# EAGLE schematic power (EAGLE 9.6.2)
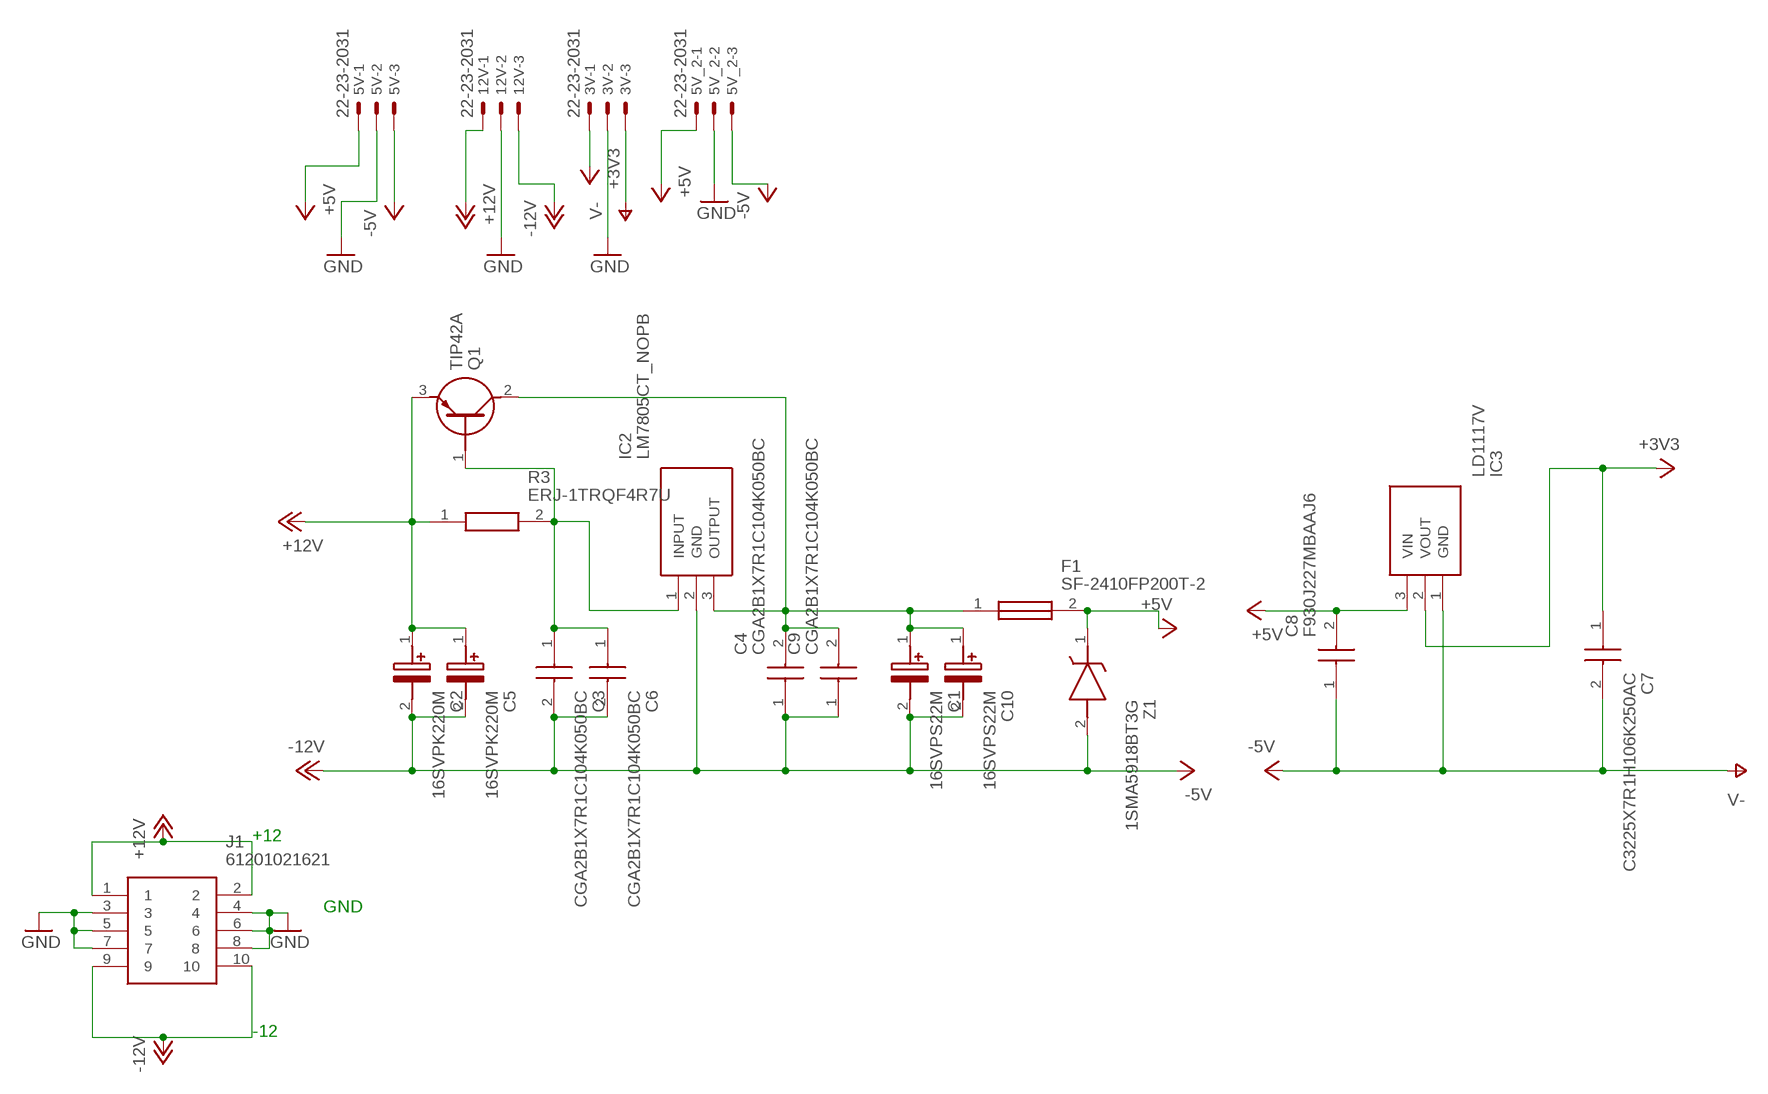
[diagram p0: schematic, sheet 1]

## Parts
3V  22-23-2031  [22-23-2031]
5V  22-23-2031  [22-23-2031]
5V_2  22-23-2031  [22-23-2031]
12V  22-23-2031  [22-23-2031]
C1  16SVPS22M  [CAPAE530X600N]
C2  16SVPK220M  [CAPAE660X600N]
C3  CGA2B1X7R1C104K050BC  [CAPC1005X55N]
C4  CGA2B1X7R1C104K050BC  [CAPC1005X55N]
C5  16SVPK220M  [CAPAE660X600N]
C6  CGA2B1X7R1C104K050BC  [CAPC1005X55N]
C7  C3225X7R1H106K250AC  [CAPC3225X230N]
C8  F930J227MBAAJ6  [CAPC3225X94N]
C9  CGA2B1X7R1C104K050BC  [CAPC1005X55N]
C10  16SVPS22M  [CAPAE530X600N]
F1  SF-2410FP200T-2  [FUSC6126X270N]
IC2  LM7805CT_NOPB  [TO254P470X1028X1955-3P]
IC3  LD1117V  [TO255P460X1020X2008-3P]
J1  61201021621  [SHDR10W64P254_2X5_2036X885X925]
Q1  TIP42A  [TO255P460X1020X2008-3P]
R3  ERJ-1TRQF4R7U  [RESC6332X71N]
Z1  1SMA5918BT3G  [DIOM5226X220N]

## Nets
+3V3: 3V.1 C7.1 IC3.2(VOUT)
+5V: 5V.1 5V_2.1 C8.2 F1.2 IC3.3(VIN) Z1.1(K)
+12V: 12V.1 C2.1(+) C5.1(+) J1.1 J1.2 Q1.3(E) R3.1(R1)
-5V: 5V.3 5V_2.3 C1.2(-) C2.2(-) C3.2 C4.1 C5.2(-) C6.2 C9.1 C10.2(-) IC2.2(GND) Z1.2(A) ; supply symbol labelled -12V
-12V: 12V.3 J1.9 J1.10
GND: 3V.2 5V.2 5V_2.2 12V.2 J1.3 J1.4 J1.5 J1.6 J1.7 J1.8
N$5: C3.1 C6.1 IC2.1(INPUT) Q1.1(B) R3.2(R2)
N$8: C1.1(+) C4.2 C9.2 C10.1(+) F1.1 IC2.3(OUTPUT) Q1.2(C)
V-: 3V.3 C7.2 C8.1 IC3.1(GND) ; supply symbol labelled -5V

## Notes on the sheet
- +12
- GND
- -12

## Library data of the parts
3V 5V 5V_2 12V = con-molex:22-23-2031: .100" (2.54mm) Center Header - 3 Pin; MF: MOLEX; MPN: 22-23-2031; OC_FARNELL: 1462950; OC_NEWARK: 30C0862
C1 C10 = SamacSys_Parts:16SVPS22M: Conductive Polymer Aluminum Solid Capacitor Source: Datasheet <https://industrial.panasonic.com/cdbs/www-data/pdf/AAB8000/AAB8000C232.pdf>; DESCRIPTION: Conductive Polymer Aluminum Solid Capacitor; HEIGHT: 6mm; MANUFACTURER_NAME: Panasonic; MANUFACTURER_PART_NUMBER: 16SVPS22M; MOUSER_PART_NUMBER: 667-16SVPS22M; MOUSER_PRICE-STOCK: https://www.mouser.co.uk/ProductDetail/Panasonic/16SVPS22M?qs=ZsfFHnjSocuR2p8724s91Q%3D%3D
C2 C5 = SamacSys_Parts:16SVPK220M: PANASONIC ELECTRONIC COMPONENTS - 16SVPK220M - CAP, 220UF, 16V, ALU ELEC, POLYMER, SMD Source: Datasheet <https://industrial.panasonic.com/cdbs/www-data/pdf/AAB8000/AAB8000C226.pdf>; DESCRIPTION: PANASONIC ELECTRONIC COMPONENTS - 16SVPK220M - CAP, 220UF, 16V, ALU ELEC, POLYMER, SMD; HEIGHT: 6mm; MANUFACTURER_NAME: Panasonic; MANUFACTURER_PART_NUMBER: 16SVPK220M; MOUSER_PART_NUMBER: 667-16SVPK220M; MOUSER_PRICE-STOCK: https://www.mouser.co.uk/ProductDetail/Panasonic/16SVPK220M?qs=PqoDHHvF648zUWDb0yGhtA%3D%3D
C3 C4 C6 C9 = SamacSys_Parts:CGA2B1X7R1C104K050BC: TDK - CGA2B1X7R1C104K050BC - CAP, MLCC, X7R, 100NF, 16V, 0402 Source: Datasheet; DESCRIPTION: TDK - CGA2B1X7R1C104K050BC - CAP, MLCC, X7R, 100NF, 16V, 0402; HEIGHT: 0.55mm; MANUFACTURER_NAME: TDK; MANUFACTURER_PART_NUMBER: CGA2B1X7R1C104K050BC; MOUSER_PART_NUMBER: 810-CGA2B1X7R1C104K; MOUSER_PRICE-STOCK: https://www.mouser.co.uk/ProductDetail/TDK/CGA2B1X7R1C104K050BC?qs=NRhsANhppD8tgIeNjgC%2Fqg%3D%3D
C7 = SamacSys_Parts:C3225X7R1H106K250AC: Multilayer Ceramic Capacitors MLCC - SMD/SMT 1210 50VDC 10uF 10% X7R Source: Datasheet <https://product.tdk.com/info/en/catalog/datasheets/mlcc_commercial_midvoltage_en.pdf>; DESCRIPTION: Multilayer Ceramic Capacitors MLCC - SMD/SMT 1210 50VDC 10uF 10% X7R; HEIGHT: 2.3mm; MANUFACTURER_NAME: TDK; MANUFACTURER_PART_NUMBER: C3225X7R1H106K250AC; MOUSER_PART_NUMBER: 810-C3225X7R1H106250; MOUSER_PRICE-STOCK: https://www.mouser.co.uk/ProductDetail/TDK/C3225X7R1H106K250AC?qs=P1JMDcb91o63VE%252BNwtSqAw%3D%3D
C8 = SamacSys_Parts:F930J227MBAAJ6: CAP TANT POLY Source: Datasheet <http://datasheets.avx.com/F93-AJ6.pdf>; DESCRIPTION: CAP TANT POLY; HEIGHT: 0.94mm; MANUFACTURER_NAME: AVX; MANUFACTURER_PART_NUMBER: F930J227MBAAJ6
F1 = SamacSys_Parts:SF-2410FP200T-2: Surface Mount Fuses Singlfuse 2410 fast-precision 2A UL 248-14 Source: Datasheet <https://www.arrow.com/en/products/sf-2410fp200t-2/bourns>; DESCRIPTION: Surface Mount Fuses Singlfuse 2410 fast-precision 2A UL 248-14; HEIGHT: 2.7mm; MANUFACTURER_NAME: Bourns; MANUFACTURER_PART_NUMBER: SF-2410FP200T-2; MOUSER_PART_NUMBER: 652-SF-2410FP200T-2; MOUSER_PRICE-STOCK: https://www.mouser.co.uk/ProductDetail/Bourns/SF-2410FP200T-2?qs=vLWxofP3U2z1E0sAfZT1pw%3D%3D
IC2 = SamacSys_Parts:LM7805CT_NOPB: 1.5-A, Wide VIN Fixed Voltage Regulators Source: Datasheet <http://www.ti.com/lit/gpn/lm7800>; DESCRIPTION: 1.5-A, Wide VIN Fixed Voltage Regulators; HEIGHT: 4.7mm; MANUFACTURER_NAME: Texas Instruments; MANUFACTURER_PART_NUMBER: LM7805CT/NOPB; MOUSER_PART_NUMBER: 926-LM7805CT/NOPB; MOUSER_PRICE-STOCK: https://www.mouser.co.uk/ProductDetail/Texas-Instruments/LM7805CT-NOPB?qs=OYMYEaN9QmBS2GvaX6GSkQ%3D%3D
IC3 = SamacSys_Parts:LD1117V: I.C. LD1117V Source: Datasheet; DESCRIPTION: I.C. LD1117V; HEIGHT: 4.6mm; MANUFACTURER_NAME: STMicroelectronics; MANUFACTURER_PART_NUMBER: LD1117V; MOUSER_PART_NUMBER: 511-LD1117V; MOUSER_PRICE-STOCK: https://www.mouser.co.uk/ProductDetail/STMicroelectronics/LD1117V?qs=tZUCD5p2VWqhC74a4KMNzA%3D%3D
J1 = SamacSys_Parts:61201021621: 10 way 2.54mm male box Header Wurth Elektronik 612 Series, 2.54mm Pitch 10 Way 2 Row Straight PCB Header, Solder Termination, 3A Source: Datasheet; DESCRIPTION: 10 way 2.54mm male box Header Wurth Elektronik 612 Series, 2.54mm Pitch 10 Way 2 Row Straight PCB Header, Solder Termination, 3A; HEIGHT: 9.25mm; MANUFACTURER_NAME: Wurth Elektronik; MANUFACTURER_PART_NUMBER: 61201021621; MOUSER_PART_NUMBER: 710-61201021621; MOUSER_PRICE-STOCK: https://www.mouser.co.uk/ProductDetail/Wurth-Elektronik/61201021621?qs=W%252B2sBeLta1a0dwX5pxbfXw%3D%3D
Q1 = SamacSys_Parts:TIP42A: TIP42A,Transistor,BJT PNP 60V 6A,TO220-3 STMicroelectronics TIP42A PNP Bipolar Transistor, 6 A, 60 V, 3-Pin TO-220 Source: Datasheet <http://www.st.com/content/ccc/resource/technical/document/datasheet/f7/e1/96/88/57/15/4a/23/CD00000922.pdf/files/CD00000922.pdf/jcr:content/translations/en.CD00000922.pdf>; DESCRIPTION: TIP42A,Transistor,BJT PNP 60V 6A,TO220-3 STMicroelectronics TIP42A PNP Bipolar Transistor, 6 A, 60 V, 3-Pin TO-220; HEIGHT: 4.6mm; MANUFACTURER_NAME: STMicroelectronics; MANUFACTURER_PART_NUMBER: TIP42A; MOUSER_PART_NUMBER: 511-TIP42A; MOUSER_PRICE-STOCK: https://www.mouser.co.uk/ProductDetail/STMicroelectronics/TIP42A?qs=ljbEvF4DwOP97wXJfsKX2Q%3D%3D
R3 = SamacSys_Parts:ERJ-1TRQF4R7U: RESISTOR, 2512 4.7 Ohm +/- 1 % 1 W Source: Datasheet <https://componentsearchengine.com/Datasheets/1/ERJ-1TRQF4R7U.pdf>; DESCRIPTION: RESISTOR, 2512 4.7 Ohm +/- 1 % 1 W; HEIGHT: mm; MANUFACTURER_NAME: Panasonic; MANUFACTURER_PART_NUMBER: ERJ-1TRQF4R7U; MOUSER_PART_NUMBER: 667-ERJ-1TRQF4R7U
Z1 = SamacSys_Parts:1SMA5918BT3G: Diode Zener 5.1V 5% 1.5W SMA ON Semiconductor 1SMA5918BT3G Zener Diode, 5.1V 5% 0.5 W SMT 2-Pin SMA Source: Datasheet <http://www.onsemi.com/pub/Collateral/1SMA5913BT3-D.PDF>; DESCRIPTION: Diode Zener 5.1V 5% 1.5W SMA ON Semiconductor 1SMA5918BT3G Zener Diode, 5.1V 5% 0.5 W SMT 2-Pin SMA; HEIGHT: 2.2mm; MANUFACTURER_NAME: ON Semiconductor; MANUFACTURER_PART_NUMBER: 1SMA5918BT3G; MOUSER_PART_NUMBER: 863-1SMA5918BT3G; MOUSER_PRICE-STOCK: https://www.mouser.co.uk/ProductDetail/ON-Semiconductor/1SMA5918BT3G?qs=y2kkmE52mdPbjBOutLmedg%3D%3D

## Net classes
0 default: width 0.635 mm, clearance 0.254 mm